# EAGLE design R3_CH340_Adapter (EAGLE 9.6.1)

## Sheet 1 of 3
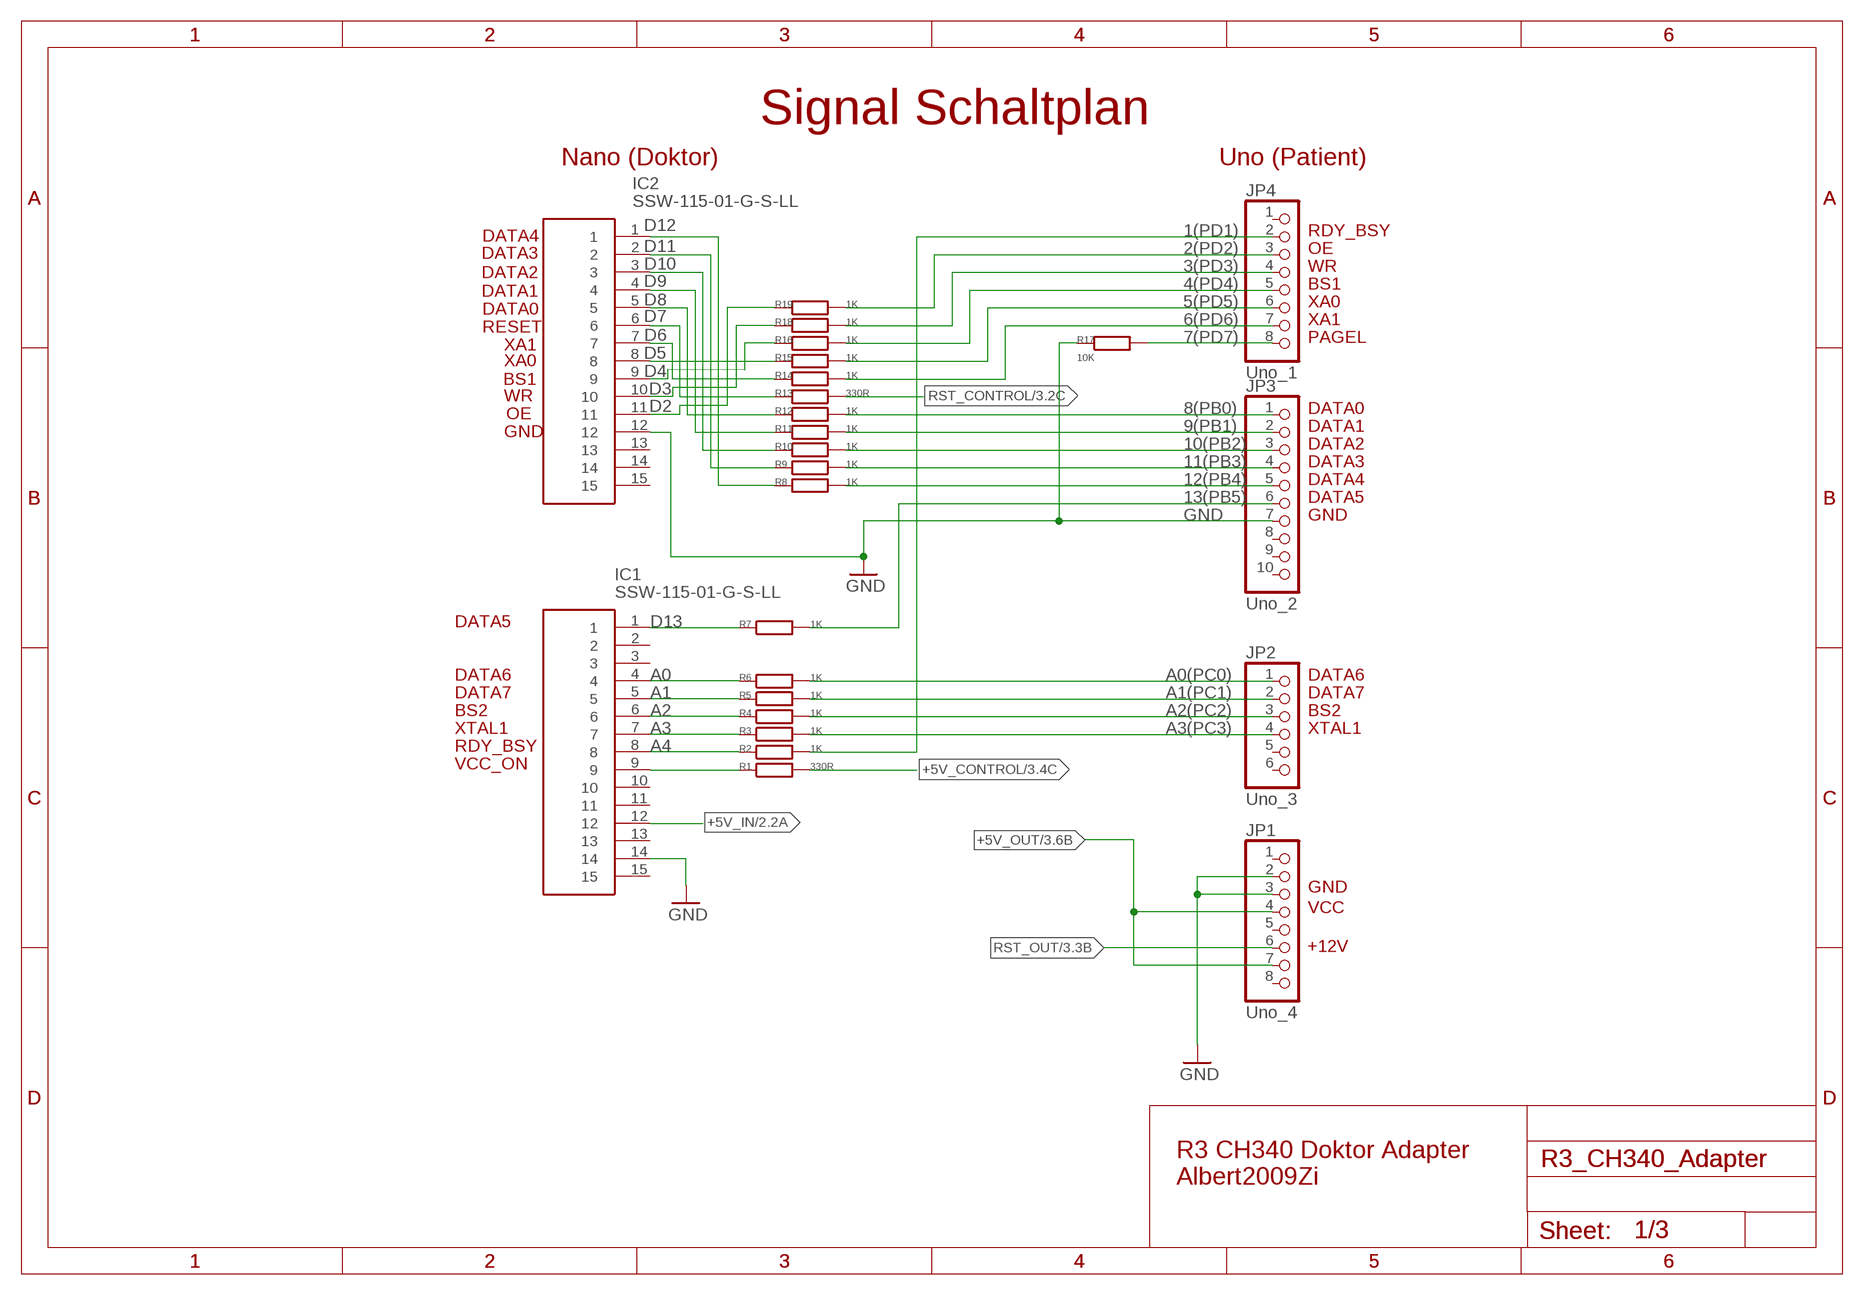
[diagram p0: schematic, sheet 1]

### Parts
IC1  SSW-115-01-G-S-LL  [RHDR15W79P0X254_1X15_3861X241X]
IC2  SSW-115-01-G-S-LL  [RHDR15W79P0X254_1X15_3861X241X]
JP1  Uno_4  PINHD-1X8  [1X08]
JP2  Uno_3  PINHD-1X6  [1X06]
JP3  Uno_2  PINHD-1X10  [1X10]
JP4  Uno_1  PINHD-1X8  [1X08]
R1  330R  R-EU_R0805  [R0805]
R2  1K  R-EU_R0805  [R0805]
R3  1K  R-EU_R0805  [R0805]
R4  1K  R-EU_R0805  [R0805]
R5  1K  R-EU_R0805  [R0805]
R6  1K  R-EU_R0805  [R0805]
R7  1K  R-EU_R0805  [R0805]
R8  1K  R-EU_R0805  [R0805]
R9  1K  R-EU_R0805  [R0805]
R10  1K  R-EU_R0805  [R0805]
R11  1K  R-EU_R0805  [R0805]
R12  1K  R-EU_R0805  [R0805]
R13  330R  R-EU_R0805  [R0805]
R14  1K  R-EU_R0805  [R0805]
R15  1K  R-EU_R0805  [R0805]
R16  1K  R-EU_R0805  [R0805]
R17  10K  R-EU_R0805  [R0805]
R18  1K  R-EU_R0805  [R0805]
R19  1K  R-EU_R0805  [R0805]

### Nets
1(PD1): JP4.2 R2.2
2(PD2): JP4.3 R19.2
3(PD3): JP4.4 R18.2
4(PD4): JP4.5 R16.2
5(PD5): JP4.6 R15.2
6(PD6): JP4.7 R14.2
7(PD7): JP4.8 R17.2
8(PB0): JP3.1 R12.2
9(PB1): JP3.2 R11.2
10(PB2): JP3.3 R10.2
11(PB3): JP3.4 R9.2
12(PB4): JP3.5 R8.2
13(PB5): JP3.6 R7.2
+5V_CONTROL: R1.2 ; also sheet 3
+5V_IN [PWR]: IC1.12 ; also sheet 2
+5V_OUT: JP1.4 JP1.7 ; also sheet 3
A0: IC1.4 R6.1
A0(PC0): JP2.1 R6.2
A1: IC1.5 R5.1
A1(PC1): JP2.2 R5.2
A2: IC1.6 R4.1
A2(PC2): JP2.3 R4.2
A3: IC1.7 R3.1
A3(PC3): JP2.4 R3.2
A4: IC1.8 R2.1
D2: IC2.11 R19.1
D3: IC2.10 R18.1
D4: IC2.9 R16.1
D5: IC2.8 R15.1
D6: IC2.7 R14.1
D7: IC2.6 R13.1
D8: IC2.5 R12.1
D9: IC2.4 R11.1
D10: IC2.3 R10.1
D11: IC2.2 R9.1
D12: IC2.1 R8.1
D13: IC1.1 R7.1
GND [GND]: IC1.14 IC2.12 JP1.2 JP1.3 JP3.7 R17.1 ; also sheet 2,3
RST_CONTROL: R13.2 ; also sheet 3
RST_OUT: JP1.6 ; also sheet 3
VCC_ON: IC1.9 R1.1
Unconnected: IC1.2 IC1.3 IC1.10 IC1.11 IC1.13 IC1.15 IC2.13 IC2.14 IC2.15 JP1.1 JP1.5 JP1.8 JP2.5 JP2.6 JP3.8 JP3.9 JP3.10 JP4.1

### Notes on the sheet
- Signal Schaltplan
- Nano (Doktor) | Uno (Patient)
- RDY_BSY
- DATA4
- DATA3 | OE
- WR
- DATA2
- BS1
- DATA1
- XA0
- DATA0
- XA1
- RESET
- PAGEL
- XA1
- XA0
- BS1
- WR
- DATA0
- OE
- DATA1
- GND
- DATA2
- DATA3
- DATA4
- DATA5
- GND
- DATA5
- DATA6 | DATA6
- DATA7 | DATA7
- BS2 | BS2
- XTAL1 | XTAL1
- RDY_BSY
- VCC_ON
- GND
- VCC
- +12V
- R3 CH340 Doktor Adapter
  Albert2009Zi

## Sheet 2 of 3
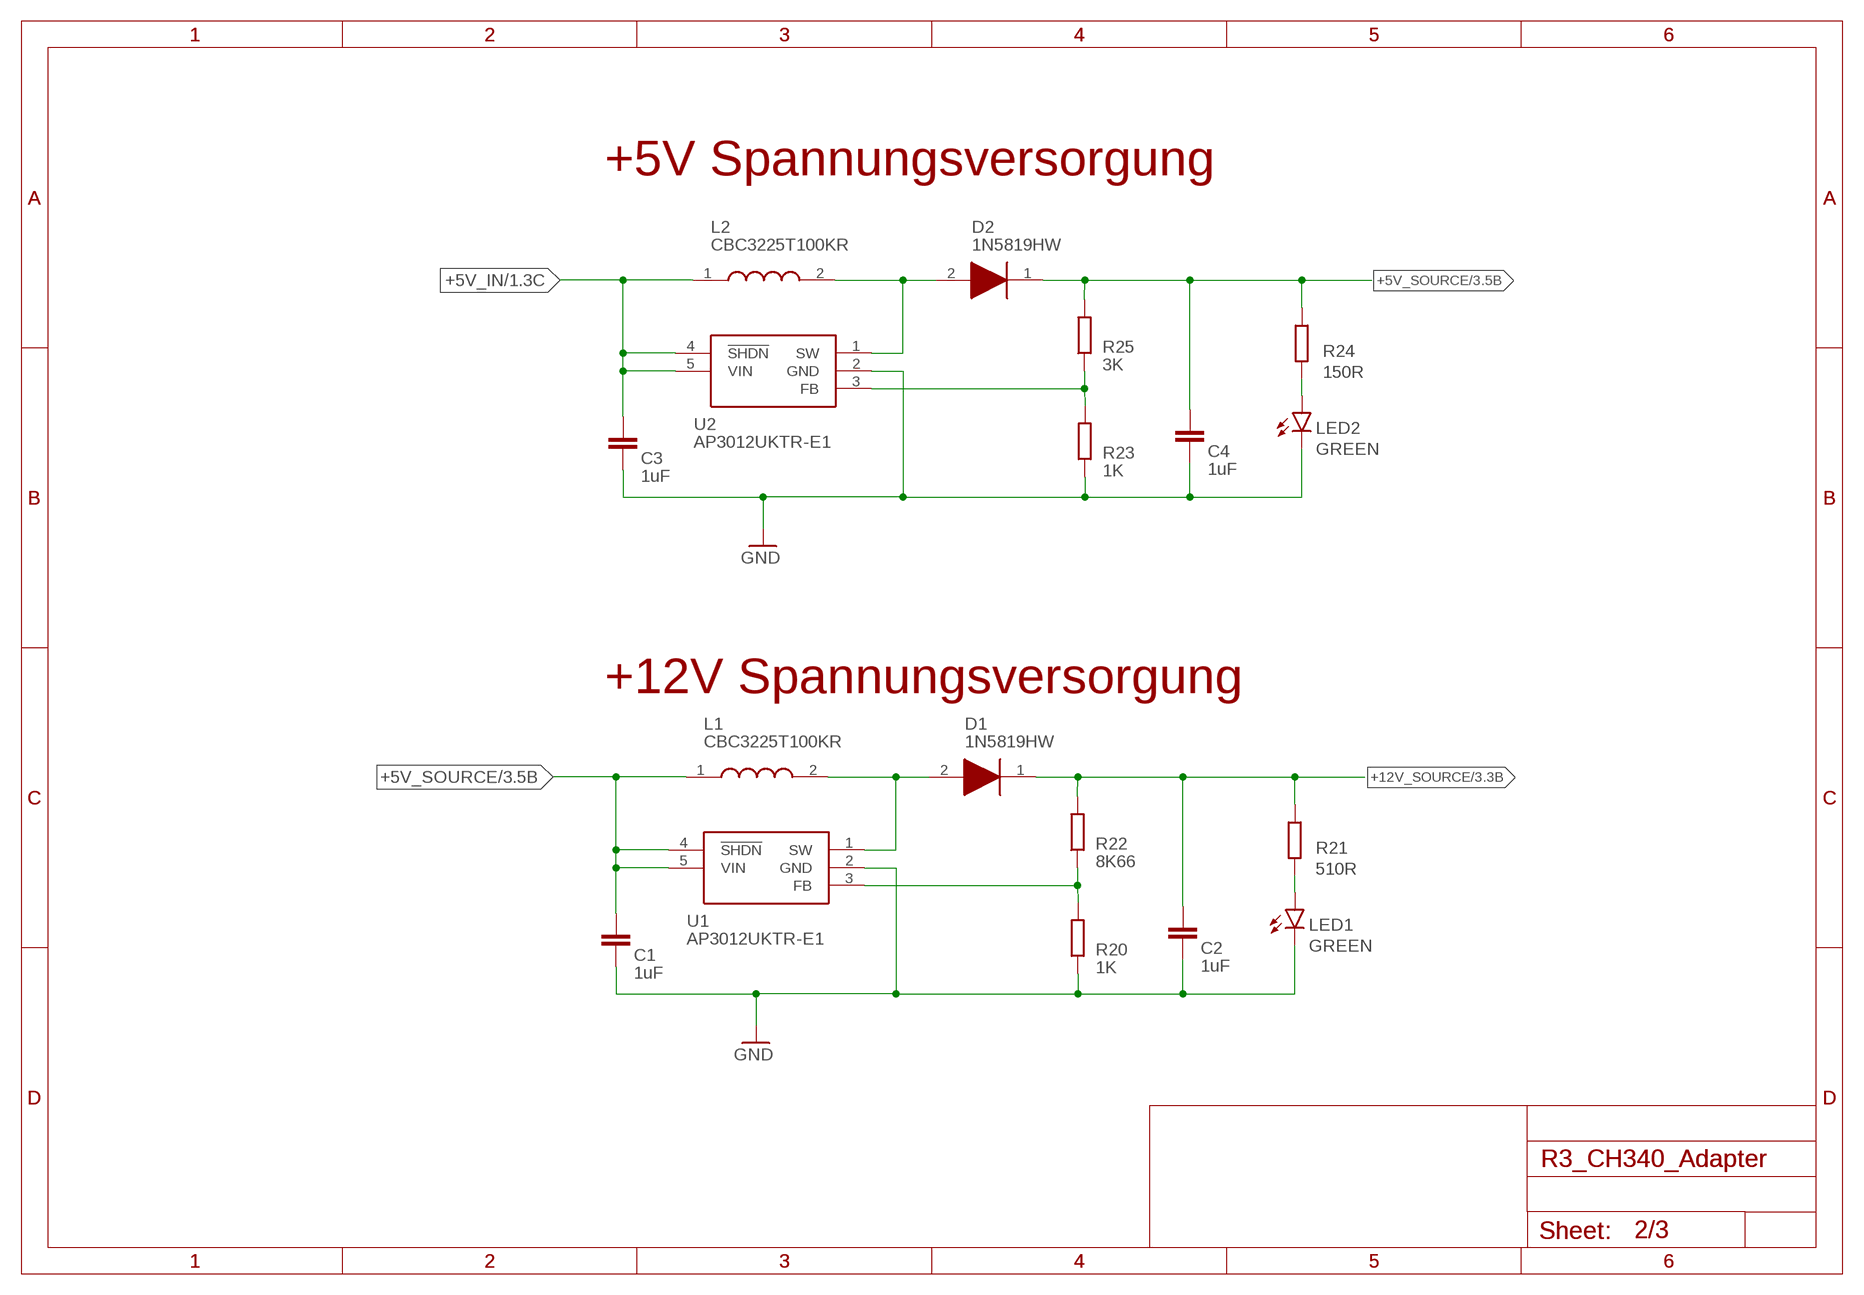
[diagram p1: schematic, sheet 2]

### Parts
C1  1uF  C-EUC0805  [C0805]
C2  1uF  C-EUC0805  [C0805]
C3  1uF  C-EUC0805  [C0805]
C4  1uF  C-EUC0805  [C0805]
D1  1N5819HW  [SOD3716X145N]
D2  1N5819HW  [SOD3716X145N]
L1  CBC3225T100KR  [INDC3225X270N]
L2  CBC3225T100KR  [INDC3225X270N]
LED1  GREEN  LEDCHIP-LED0805  [CHIP-LED0805]
LED2  GREEN  LEDCHIP-LED0805  [CHIP-LED0805]
R20  1K  R-EU_R0805  [R0805]
R21  510R  R-EU_R0805  [R0805]
R22  8K66  R-EU_R0805  [R0805]
R23  1K  R-EU_R0805  [R0805]
R24  150R  R-EU_R0805  [R0805]
R25  3K  R-EU_R0805  [R0805]
U1  AP3012UKTR-E1  [SOT95P280X145-5N]
U2  AP3012UKTR-E1  [SOT95P280X145-5N]

### Nets
+5V_IN [PWR]: C3.1 L2.1 U2.4(!SHDN) U2.5(VIN) ; also sheet 1
+5V_SOURCE [PWR]: C1.1 C4.1 D2.1(K) L1.1 R24.1 R25.2 U1.4(!SHDN) U1.5(VIN) ; also sheet 3
+12V_SOURCE [PWR]: C2.1 D1.1(K) R21.1 R22.2 ; also sheet 3
GND [GND]: C1.2 C2.2 C3.2 C4.2 LED1.C LED2.C R20.1 R23.1 U1.2(GND) U2.2(GND) ; also sheet 1,3
N$1: D2.2(A) L2.2 U2.1(SW)
N$3: R23.2 R25.1 U2.3(FB)
N$5: D1.2(A) L1.2 U1.1(SW)
N$6: R20.2 R22.1 U1.3(FB)
N$10: LED2.A R24.2
N$12: LED1.A R21.2

### Notes on the sheet
- +5V Spannungsversorgung
- +12V Spannungsversorgung

## Sheet 3 of 3
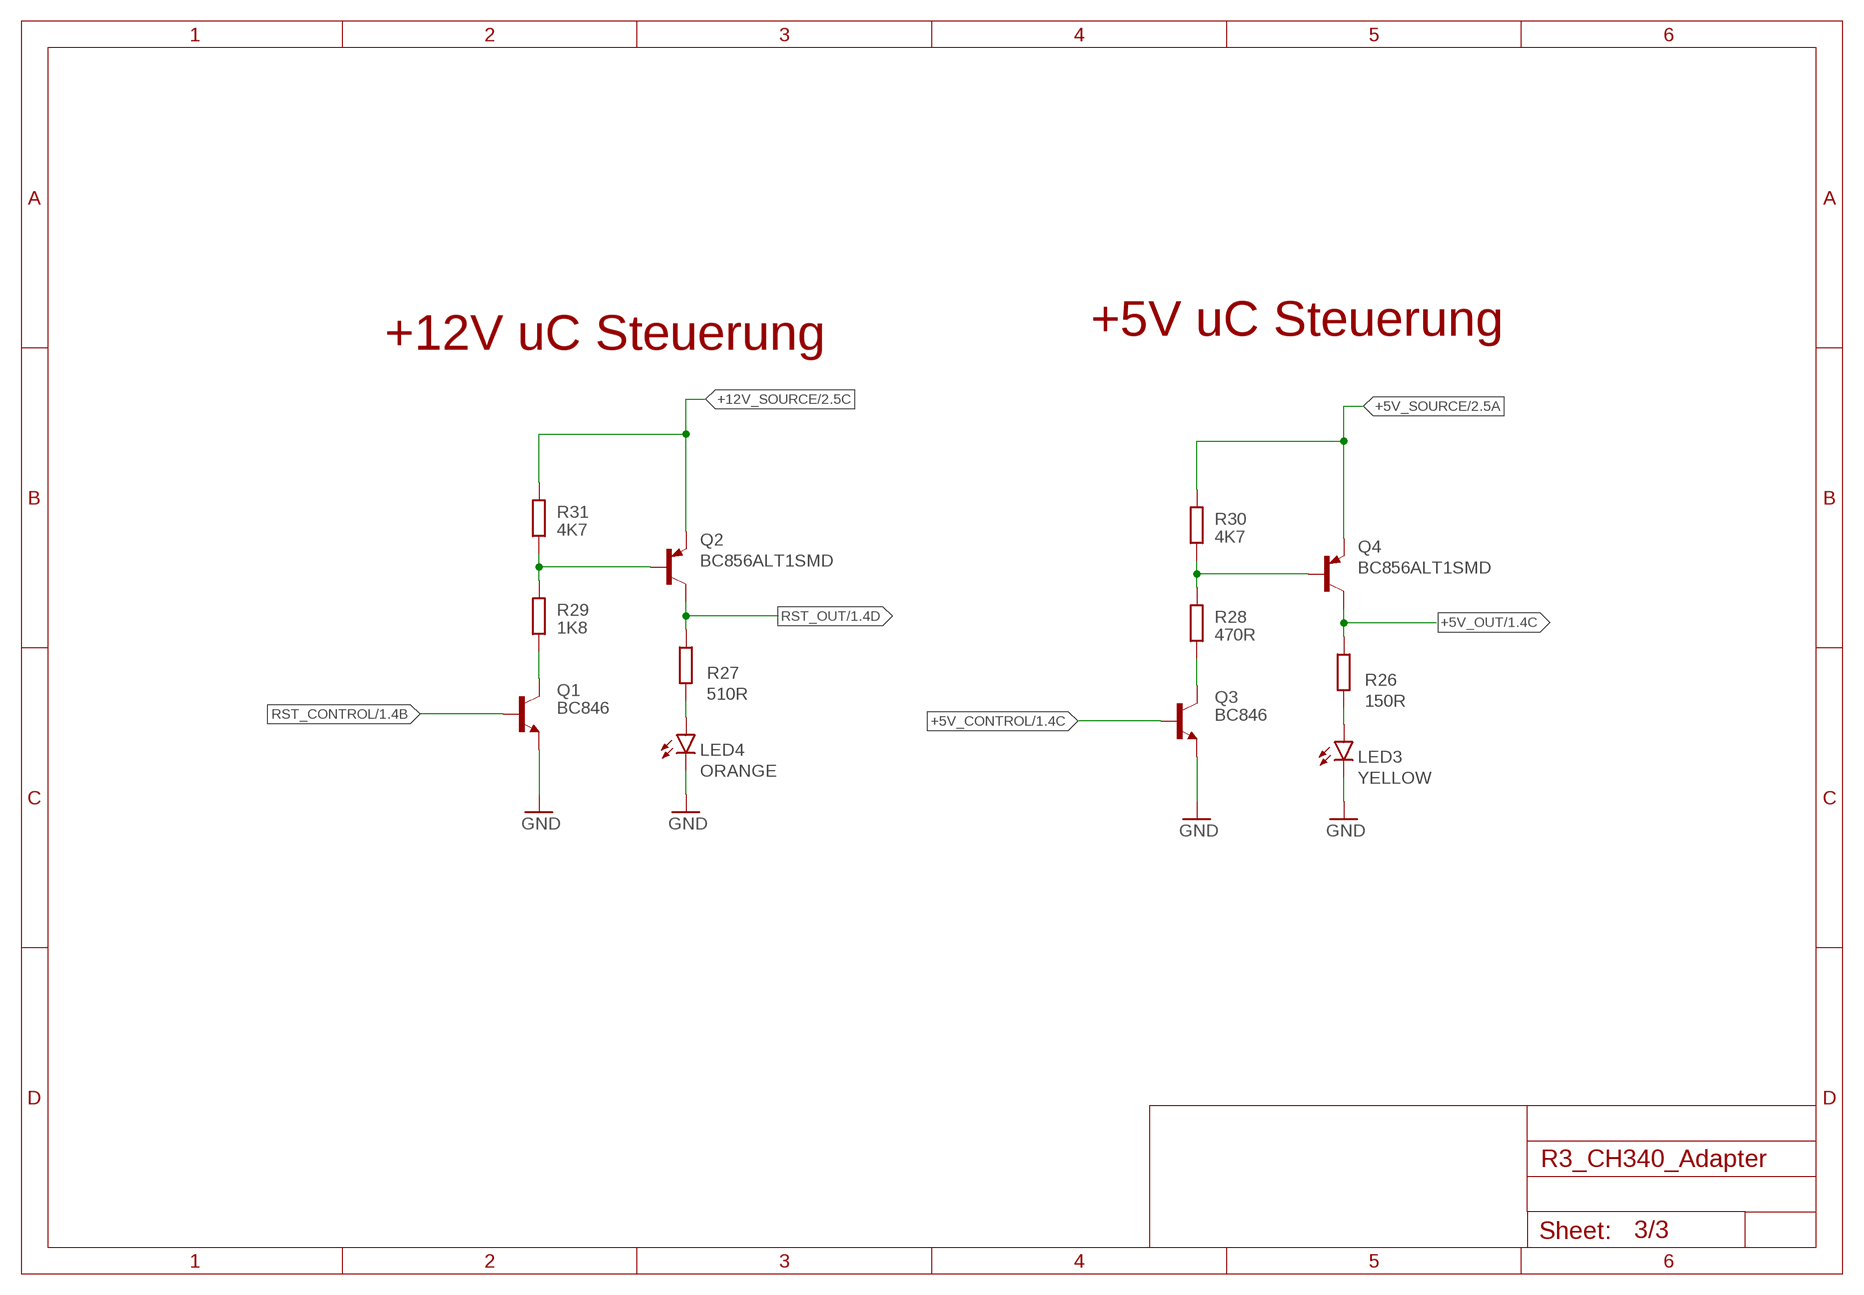
[diagram p2: schematic, sheet 3]

### Parts
LED3  YELLOW  LEDCHIP-LED0805  [CHIP-LED0805]
LED4  ORANGE  LEDCHIP-LED0805  [CHIP-LED0805]
Q1  BC846  [SOT23]
Q2  BC856ALT1SMD  [SOT23-BEC]
Q3  BC846  [SOT23]
Q4  BC856ALT1SMD  [SOT23-BEC]
R26  150R  R-EU_R0805  [R0805]
R27  510R  R-EU_R0805  [R0805]
R28  470R  R-EU_R0805  [R0805]
R29  1K8  R-EU_R0805  [R0805]
R30  4K7  R-EU_R0805  [R0805]
R31  4K7  R-EU_R0805  [R0805]

### Nets
+5V_CONTROL: Q3.1(B) ; also sheet 1
+5V_OUT: Q4.C R26.1 ; also sheet 1
+5V_SOURCE [PWR]: Q4.E R30.2 ; also sheet 2
+12V_SOURCE [PWR]: Q2.E R31.2 ; also sheet 2
GND [GND]: LED3.C LED4.C Q1.2(E) Q3.2(E) ; also sheet 1,2
N$2: Q2.B R29.2 R31.1
N$4: LED4.A R27.2
N$7: Q4.B R28.2 R30.1
N$8: LED3.A R26.2
N$9: Q3.3(C) R28.1
N$11: Q1.3(C) R29.1
RST_CONTROL: Q1.1(B) ; also sheet 1
RST_OUT: Q2.C R27.1 ; also sheet 1

### Notes on the sheet
- +12V uC Steuerung | +5V uC Steuerung

## Library data of the parts
C1-C4 = rcl:C-EU: CAPACITOR, European symbol; SPICEPREFIX: C
D1 D2 = Schottky_1N58xx:1N5819HW: 1.0A SURFACE MOUNT SCHOTTKY BARRIER RECTIFIER Source: Datasheet <http://www.diodes.com/_files/datasheets/ds30217.pdf>; DESCRIPTION: 1.0A SURFACE MOUNT SCHOTTKY BARRIER RECTIFIER; HEIGHT: 1.45mm; MANUFACTURER_NAME: Diodes Inc.; MANUFACTURER_PART_NUMBER: 1N5819HW
IC1 IC2 = SamacSys_Parts:SSW-115-01-G-S-LL: Board to Board & Mezzanine Connectors .100" Tiger Buy Socket Strip Source: Datasheet <https://componentsearchengine.com/Datasheets/1/SSW-115-01-G-S-LL.pdf>; ARROW_PART_NUMBER: SSW-115-01-G-S-LL; ARROW_PRICE-STOCK: https://www.arrow.com/en/products/ssw-115-01-g-s-ll/samtec?region=nac; DESCRIPTION: Board to Board & Mezzanine Connectors .100" Tiger Buy Socket Strip; HEIGHT: 8.51mm; MANUFACTURER_NAME: SAMTEC; MANUFACTURER_PART_NUMBER: SSW-115-01-G-S-LL; MOUSER_PART_NUMBER: 200-SSW11501GSLL; MOUSER_PRICE-STOCK: https://www.mouser.co.uk/ProductDetail/Samtec/SSW-115-01-G-S-LL?qs=rU5fayqh%252BE2DWkaSQZyn6w%3D%3D
JP1 JP4 = pinhead:PINHD-1X8: PIN HEADER
JP2 = pinhead:PINHD-1X6: PIN HEADER
JP3 = pinhead:PINHD-1X10: PIN HEADER
L1 L2 = SMD_Indukt:CBC3225T100KR: Fixed Inductors 1210 10uH 172.9mOhms +/-10% 900mA HiCur Source: Datasheet <https://mouser.componentsearchengine.com/Datasheets/1/CBC3225T100KR.pdf>; ARROW_PART_NUMBER: CBC3225T100KR; ARROW_PRICE-STOCK: https://www.arrow.com/en/products/cbc3225t100kr/taiyo-yuden; DESCRIPTION: Fixed Inductors 1210 10uH 172.9mOhms +/-10% 900mA HiCur; HEIGHT: 2.7mm; MANUFACTURER_NAME: TAIYO YUDEN; MANUFACTURER_PART_NUMBER: CBC3225T100KR; MOUSER_PART_NUMBER: 963-CBC3225T100KR; MOUSER_PRICE-STOCK: https://www.mouser.co.uk/ProductDetail/Taiyo-Yuden/CBC3225T100KR?qs=I6KAKw0tg2xBtBHDie3dYA%3D%3D
LED1-LED4 = led:LED: LED OSRAM: - CHIPLED LG R971, LG N971, LY N971, LG Q971, LY Q971, LO R971, LY R971 LH N974, LH R974 LS Q976, LO Q976, LY Q976 LO Q996 - Hyper CHIPLED LW Q18S LB Q993, LB Q99A, LB R99A - SideLED LS A670, LO A670, LY A670, LG A670, LP A670 LB A673, LV A673, LT A673, LW A673 LH A674 LY A675 LS A676, LA A676, LO A676, LY A676, LW A676 LS A679, LY A679, LG A679 - Hyper Micro SIDELED® LS Y876, LA Y876, LO Y876, LY Y876 LT Y87S - SmartLED LW L88C, LW L88S LB L89C, LB L89S, LG L890 LS L89K, LO L89K, LY L89K LS L896, LA L896, LO L896, LY L896 - TOPLED LS T670, LO T670, LY T670, LG T670, LP T670 LSG T670, LSP T670, LSY T670, LOP T670, LYG T670 LG T671, LOG T671, LSG T671 LB T673, LV T673, LT T673, LW T673 LH T674 LS T676, LA T676, LO T676, LY T676, LB T676, LH T676, LSB T676, LW T676 LB T67C, LV T67C, LT T67C, LS T67K, LO T67K, LY T67K, LW E67C LS E67B, LA E67B, LO E67B, LY E67B, LB E67C, LV E67C, LT E67C LW T67C LS T679, LY T679, LG T679 LS T770, LO T770, LY T770, LG T770, LP T770 LB T773, LV T773, LT T773, LW T773 LH T774 LS E675, LA E675, LY E675, LS T675 LS T776, LA T776, LO T776, LY T776, LB T776 LHGB T686 LT T68C, LB T68C - Hyper Mini TOPLED® LB M676 - Mini TOPLED Santana® LG M470 LS M47K, LO M47K, LY M47K Source: http://www.osram.convergy.de LUXEON: - LUMILED® LXK2-PW12-R00, LXK2-PW12-S00, LXK2-PW14-U00, LXK2-PW14-V00 LXK2-PM12-R00, LXK2-PM12-S00, LXK2-PM14-U00 LXK2-PE12-Q00, LXK2-PE12-R00, LXK2-PE12-S00, LXK2-PE14-T00, LXK2-PE14-U00 LXK2-PB12-K00, LXK2-PB12-L00, LXK2-PB12-M00, LXK2-PB14-N00, LXK2-PB14-P00, LXK2-PB14-Q00 LXK2-PR12-L00, LXK2-PR12-M00, LXK2-PR14-Q00, LXK2-PR14-R00 LXK2-PD12-Q00, LXK2-PD12-R00, LXK2-PD12-S00 LXK2-PH12-R00, LXK2-PH12-S00 LXK2-PL12-P00, LXK2-PL12-Q00, LXK2-PL12-R00 Source: www.luxeon.com KINGBRIGHT: KA-3528ASYC Source: www.kingbright.com
Q1 Q3 = transistor:BC846: NPN TRANSISTOR
Q2 Q4 = transistor-pnp:BC856*: PNP Transistror
R1-R31 = rcl:R-EU_: RESISTOR, European symbol; SPICEPREFIX: R
U1 U2 = Baby_Moji_Spannungsplatine:AP3012UKTR-E1: IC REG BOOST ADJ 500MA SOT23-5 Source: Datasheet <https://componentsearchengine.com/Datasheets/1/AP3012UKTR-E1.pdf>; ARROW_PART_NUMBER: AP3012UKTR-E1; ARROW_PRICE-STOCK: https://www.arrow.com/en/products/ap3012uktr-e1/diodes-incorporated; DESCRIPTION: IC REG BOOST ADJ 500MA SOT23-5; HEIGHT: 1.45mm; MANUFACTURER_NAME: Diodes Inc.; MANUFACTURER_PART_NUMBER: AP3012UKTR-E1; MOUSER_PART_NUMBER: 621-AP3012UKTR-E1; MOUSER_PRICE-STOCK: https://www.mouser.com/Search/Refine.aspx?Keyword=621-AP3012UKTR-E1

## Net classes
0 default: width 0.152 mm, drill 0.3 mm, clearance 0.152 mm
1 GND: width 0.406 mm, drill 0.4 mm, clearance 0.3 mm
2 PWR: width 0.406 mm, drill 0.4 mm, clearance 0.152 mm

## Board
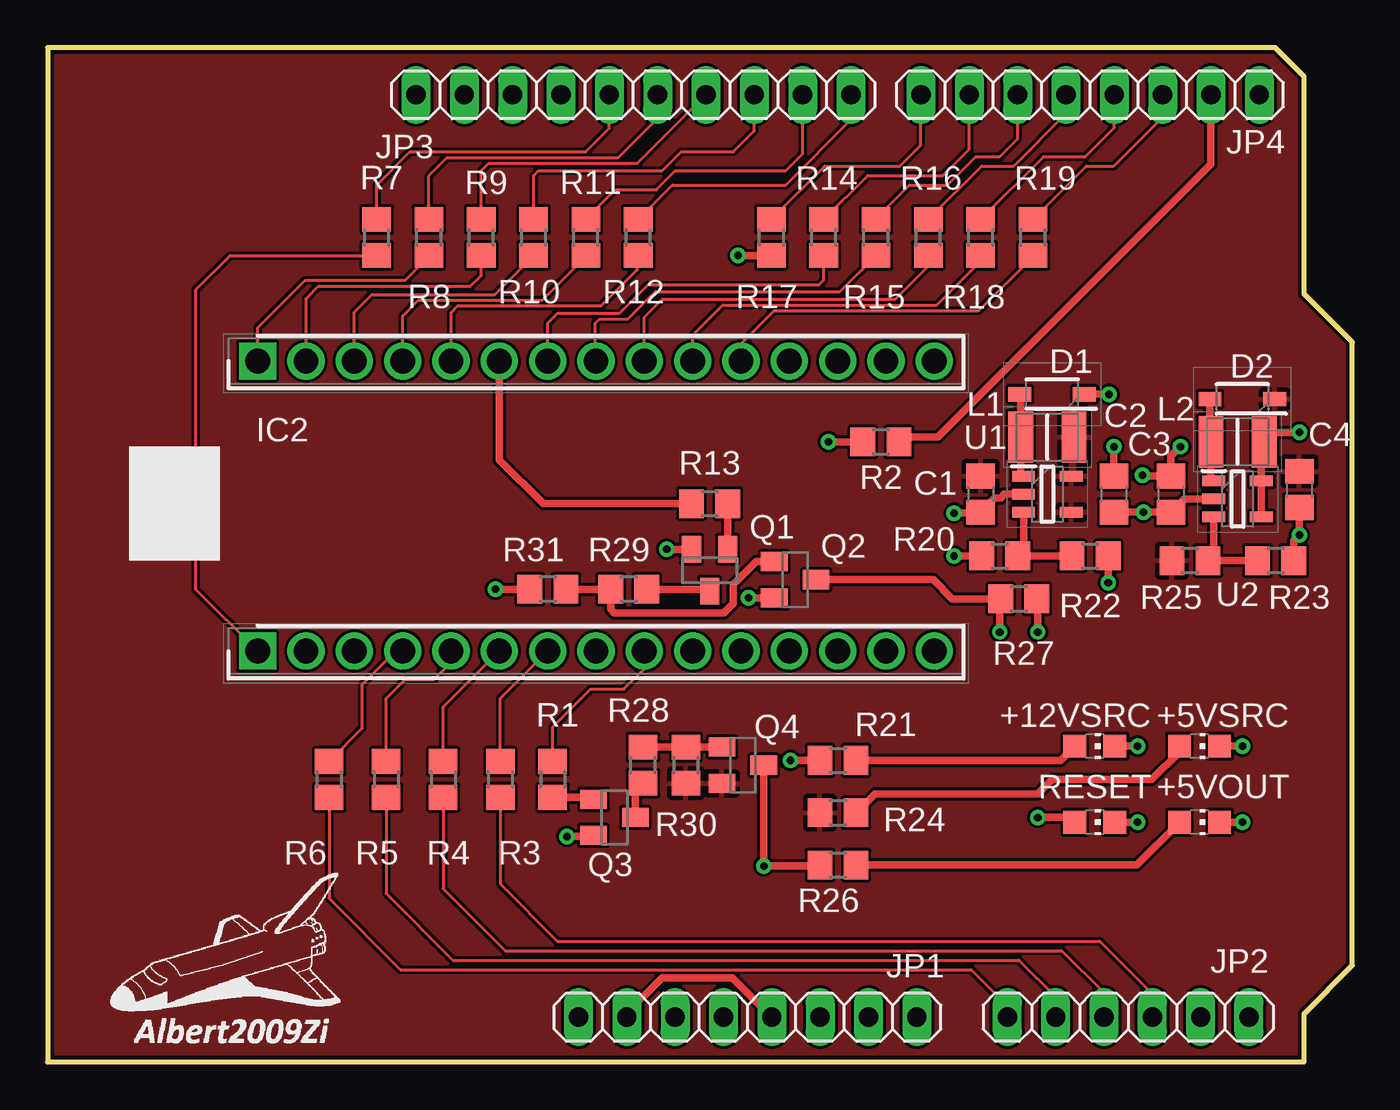
[diagram p3: board, top side]
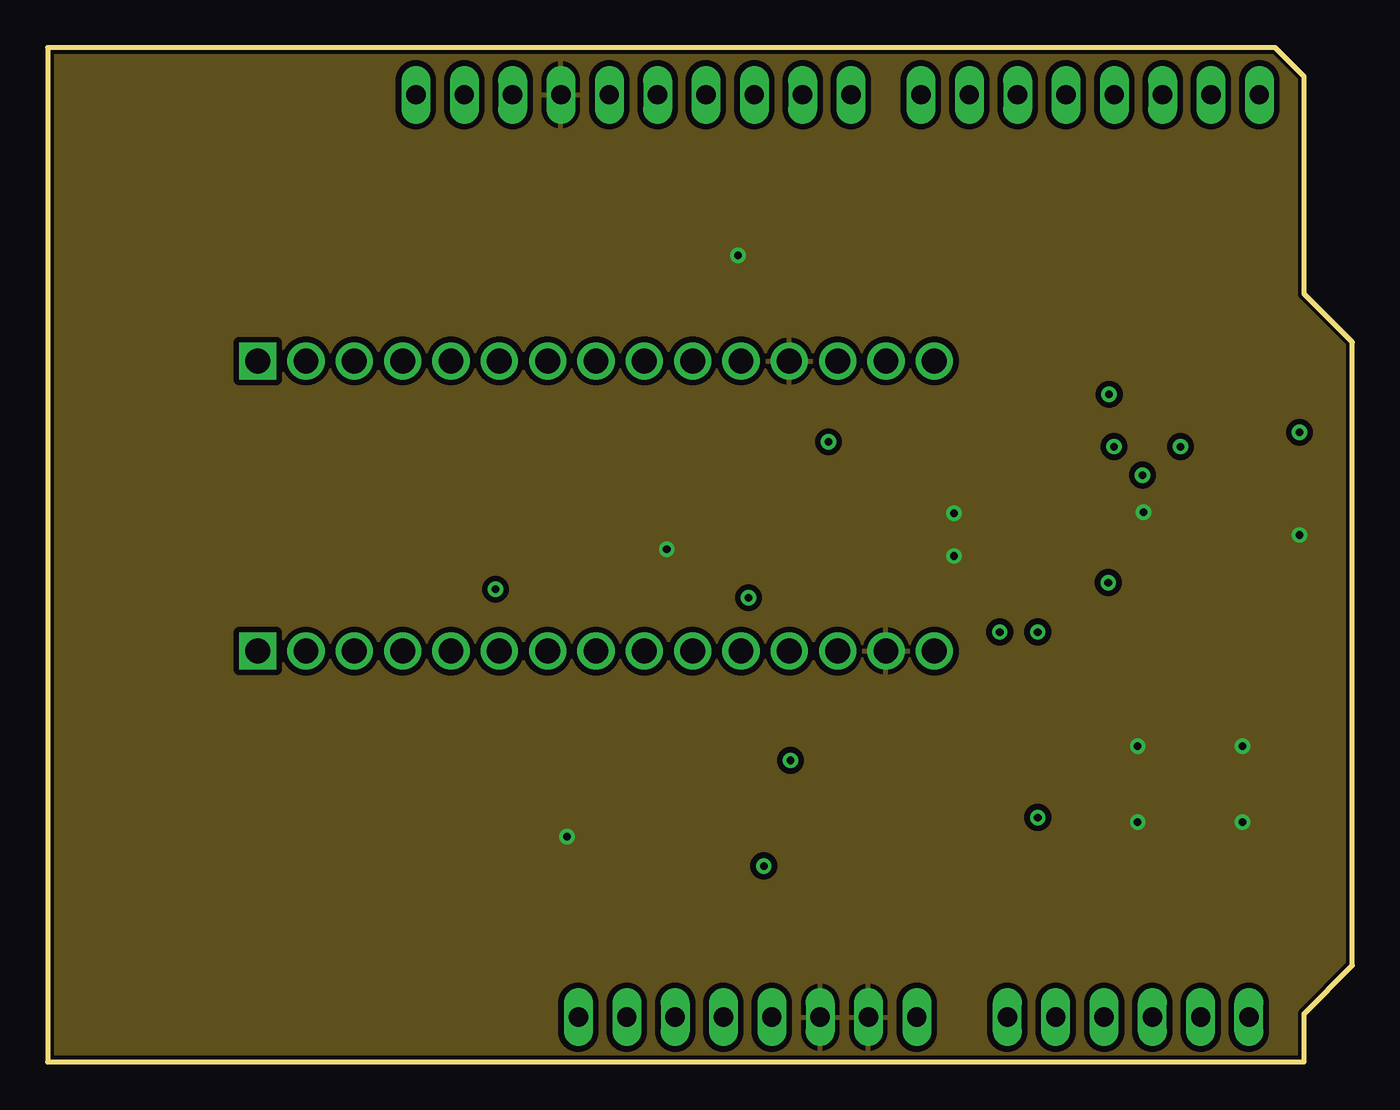
[diagram p4: board, inner layer Route2]
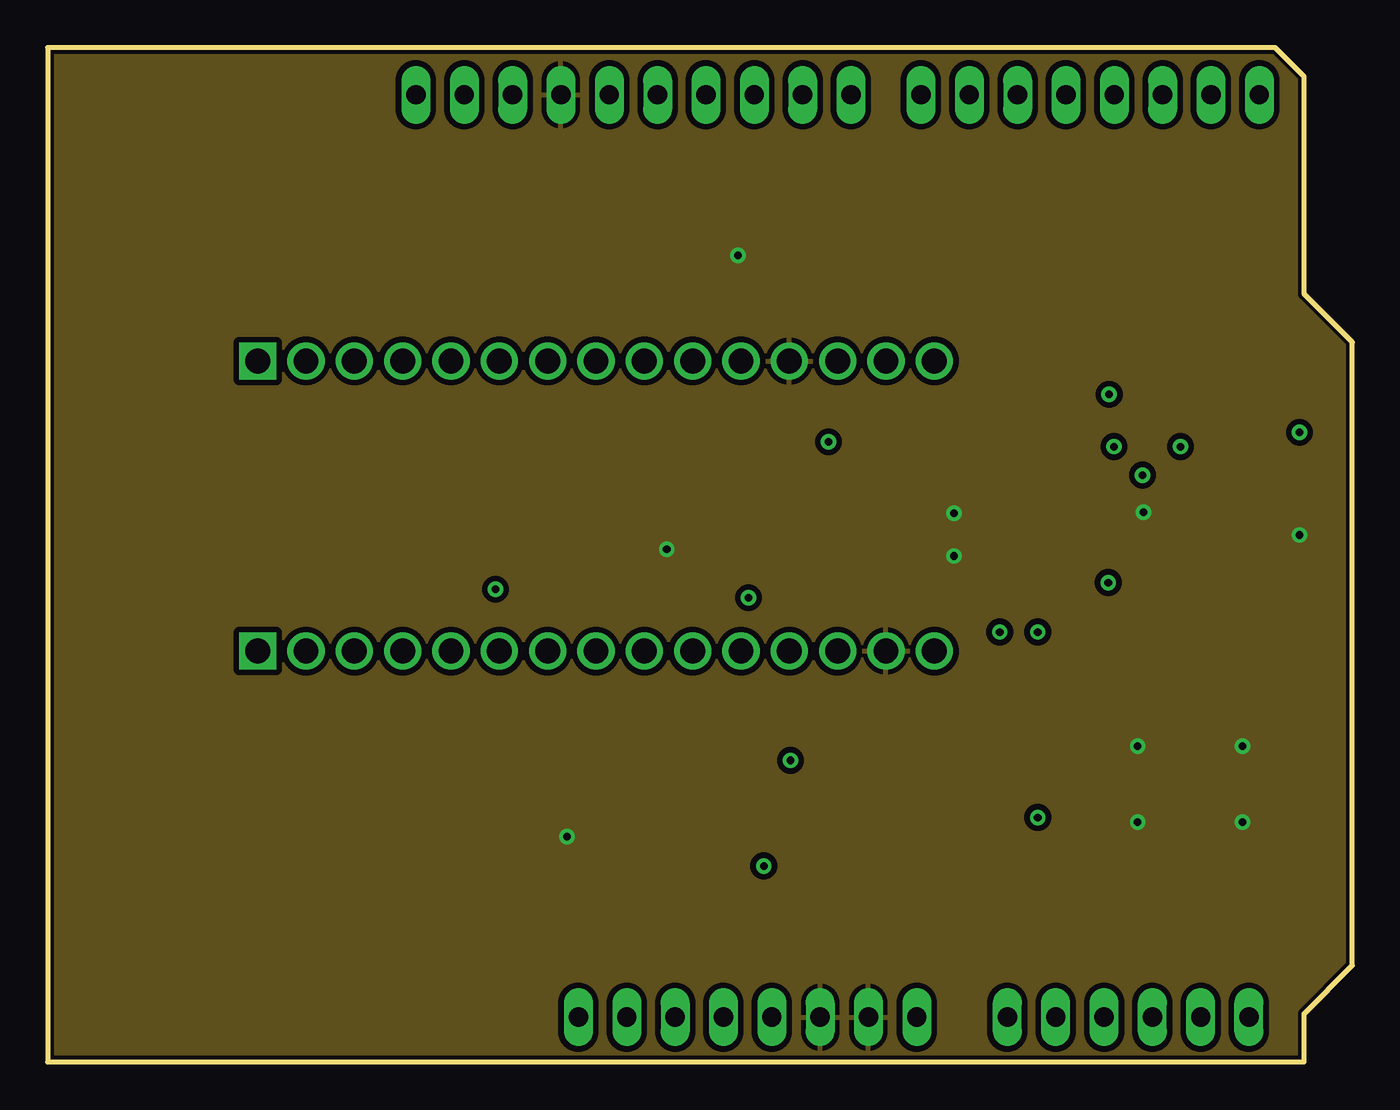
[diagram p5: board, inner layer Route15]
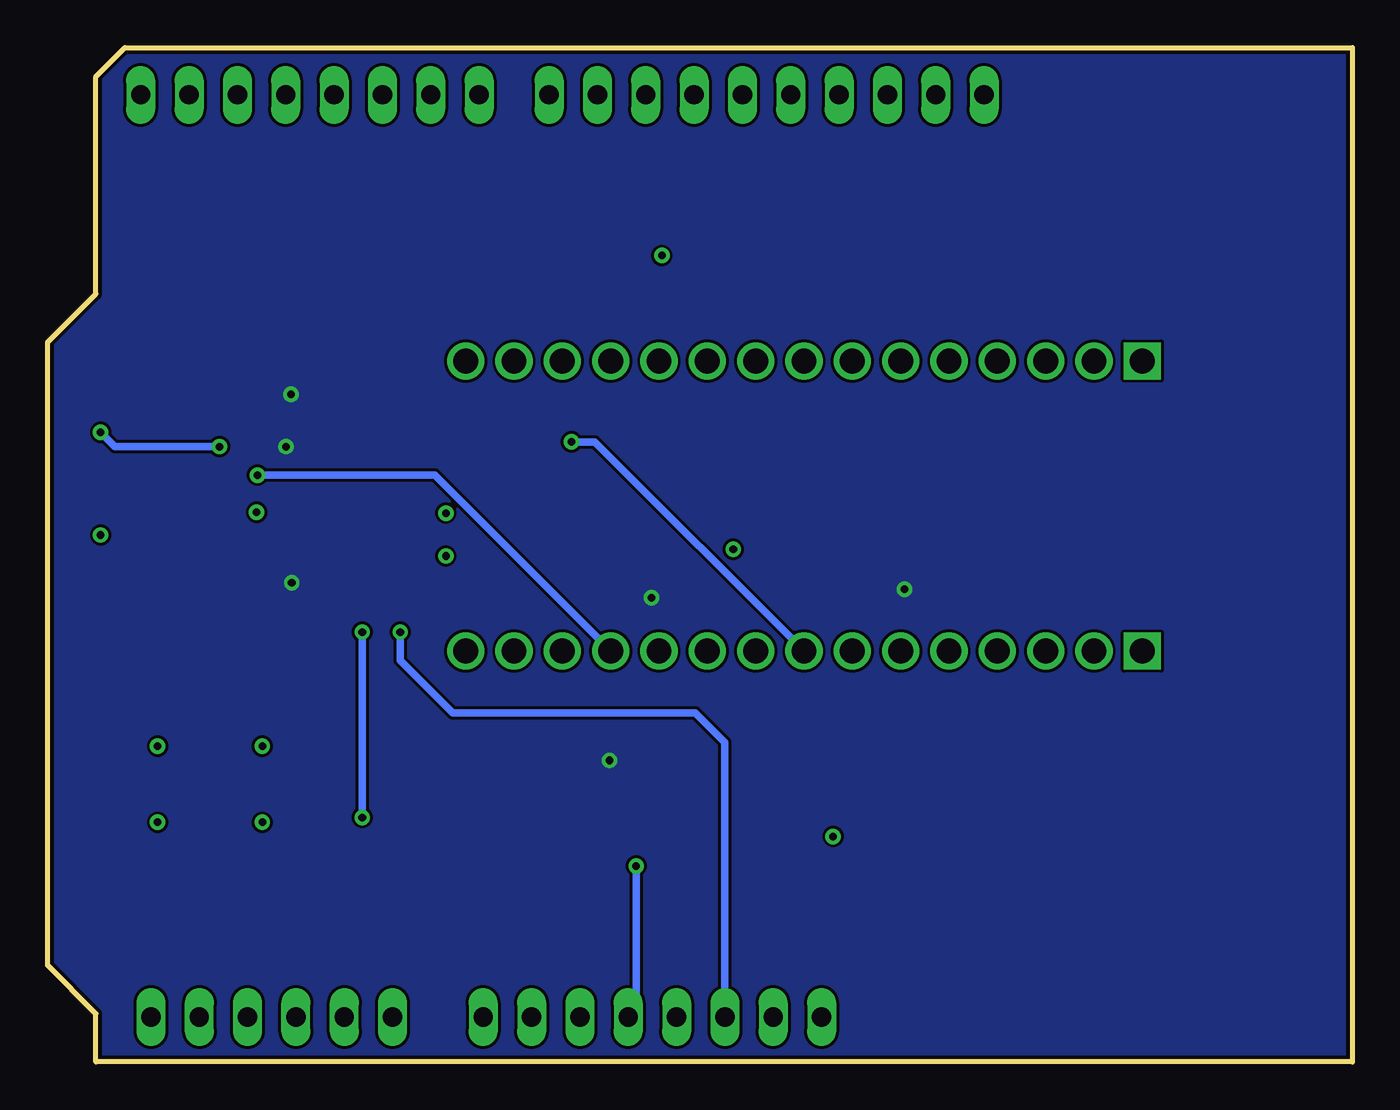
[diagram p6: board, bottom side, seen from below]

Size 68.58 x 53.34 mm. Coordinates in mm from the lower left corner, seen from the top.
Outline: 0,53.34 0,0 66.04,0 66.04,2.54 68.58,5.08 68.58,37.85 66.04,40.39 66.04,51.82 64.52,53.34 0,53.34
Copper layers (1+2*15+16): Top 0.035mm / dielectric 0.6mm / Route2 0.035mm / dielectric 0.25mm / Route15 0.035mm / dielectric 0.6mm / Bottom 0.035mm
Design rules "default *": minimum track width 3mil, minimum drill 12mil, track to track 6mil, track to pad 6mil, pad to pad 6mil, via to via 6mil, smd to smd 6mil, copper to edge 0.2mm, drill to drill 32mil, minimum pad ring 10mil, minimum via ring 8mil, stop-mask expansion 4mil, vias tented up to drill 0mil, thermal gap 10mil

### Footprints (pad centres in the part's own frame; a part is rotated, then mirrored left to right if it is on the bottom)
C0805 = smd 1.3 x 1.5: 1 -0.95,0; 2 0.95,0
SOD3716X145N = smd 1.2 x 0.75: 1 -1.7,0; 2 1.7,0
RHDR15W79P0X254_1X15_3861X241X = drill 1.3 pad 1.95 square: 1 0,0 | drill 1.3 pad 1.95: 2 -2.54,0; 3 -5.08,0; 4 -7.62,0; 5 -10.16,0; 6 -12.7,0; 7 -15.24,0; 8 -17.78,0; 9 -20.32,0; 10 -22.86,0; 11 -25.4,0; 12 -27.94,0; 13 -30.48,0; 14 -33.02,0; 15 -35.56,0
1X08 = drill 1.016 long: 1 -8.89,0; 2 -6.35,0; 3 -3.81,0; 4 -1.27,0; 5 1.27,0; 6 3.81,0; 7 6.35,0; 8 8.89,0
1X06 = drill 1.016 long: 1 -6.35,0; 2 -3.81,0; 3 -1.27,0; 4 1.27,0; 5 3.81,0; 6 6.35,0
1X10 = drill 1.016 long: 1 -11.43,0; 2 -8.89,0; 3 -6.35,0; 4 -3.81,0; 5 -1.27,0; 6 1.27,0; 7 3.81,0; 8 6.35,0; 9 8.89,0; 10 11.43,0
INDC3225X270N = smd 1.3 x 2.7: 1 -1.4,0; 2 1.4,0
CHIP-LED0805 = smd 1.2 x 1.2: A 0,-1.05; C 0,1.05
SOT23 = smd 1 x 1.4: 1 -0.95,-1.1; 2 0.95,-1.1; 3 0,1.1
SOT23-BEC = smd 1 x 1.4: B -0.95,-1.1; C 0,1.1; E 0.95,-1.1
R0805 = smd 1.3 x 1.5: 1 -0.95,0; 2 0.95,0
SOT95P280X145-5N = smd 1.2 x 0.55: 1 -1.25,0.95; 2 -1.25,0; 3 -1.25,-0.95; 4 1.25,-0.95; 5 1.25,0.95

### Placement (x,y rotation side)
C1  49.04,29.86 270 top
C2  56.04,29.86 270 top
C3  59.04,29.86 270 top
C4  65.79,30.11 270 top
D1  52.79,35.11 180 top
D2  62.79,34.86 180 top
E$1  [LOGO_SMALL]  3.04,0.61 0 top
IC1  11.04,21.61 180 top
IC2  11.04,36.86 180 top
JP1  36.79,2.36 180 top
JP2  56.79,2.36 0 top
JP3  30.79,50.86 180 top
JP4  54.79,50.86 180 top
L1  52.54,32.86 180 top
L2  62.54,32.61 180 top
LED1  55.04,16.61 270 top
LED2  60.54,16.61 270 top
LED3  60.54,12.61 270 top
LED4  55.04,12.61 270 top
Q1  34.79,25.86 180 top
Q2  39.29,25.36 270 top
Q3  29.79,12.86 270 top
Q4  36.54,15.61 270 top
R1  26.54,14.86 270 top
R2  43.79,32.61 0 top
R3  23.79,14.86 270 top
R4  20.79,14.86 270 top
R5  17.79,14.86 270 top
R6  14.79,14.86 270 top
R7  17.29,43.36 90 top
R8  20.04,43.36 90 top
R9  22.79,43.36 90 top
R10  25.54,43.36 90 top
R11  28.29,43.36 90 top
R12  31.04,43.36 90 top
R13  34.79,29.36 0 top
R14  40.79,43.36 90 top
R15  43.54,43.36 90 top
R16  46.29,43.36 90 top
R17  38.04,43.36 90 top
R18  49.04,43.36 90 top
R19  51.79,43.36 90 top
R20  50.04,26.61 0 top
R21  41.54,15.86 0 top
R22  54.79,26.61 0 top
R23  64.54,26.36 180 top
R24  41.54,13.11 0 top
R25  60.04,26.36 180 top
R26  41.54,10.36 0 top
R27  51.04,24.36 0 top
R28  1K8  [R0805]  31.29,15.61 90 top
R29  30.54,24.86 180 top
R30  33.54,15.61 270 top
R31  26.29,24.86 180 top
U1  52.54,29.86 0 top
U2  62.54,29.61 0 top

### Tracks (layer width: path | path; a pad name or v marks a point on that pad's centre or on a via)
1(PD1)
  Top 0.406: R2.2 44.99,32.86 46.79,32.86 61.14,47.21 JP4.2
2(PD2)
  Top 0.152: R19.2 54.59,47.11 56.04,47.11 58.6,49.67 JP4.3
3(PD3)
  Top 0.152: R18.2 52.34,47.61 54.54,47.61 56.06,49.13 JP4.4
4(PD4)
  Top 0.152: R16.2 49.09,47.11 50.77,47.11 53.52,49.86 JP4.5
5(PD5)
  Top 0.152: JP4.6 50.98,48.55 50.04,47.61 48.79,47.61 47.29,46.11 45.29,46.11 43.54,44.36 R15.2
6(PD6)
  Top 0.152: R14.2 43.09,46.61 47.04,46.61 48.44,48.01 JP4.7
7(PD7)
  Top 0.152: R17.2 40.84,47.11 44.79,47.11 45.9,48.22 JP4.8
8(PB0)
  Top 0.152: R12.2 32.84,46.11 38.79,46.11 42.22,49.54 JP3.1
9(PB1)
  Top 0.152: R11.2 29.84,45.86 31.99,45.86 32.99,46.86 38.79,46.86 39.68,47.75 JP3.2
10(PB2)
  Top 0.152: R10.2 25.54,46.61 25.79,46.86 32.29,46.86 33.29,47.86 36.04,47.86 37.14,48.96 JP3.3
11(PB3)
  Top 0.152: R9.2 22.79,46.86 23.18,47.25 30.99,47.25 JP3.4
12(PB4)
  Top 0.152: R8.2 20.04,46.61 20.99,47.55 29.99,47.55 32.06,49.63 JP3.5
13(PB5)
  Top 0.152: R7.2 17.29,46.11 19.04,47.86 28.29,47.86 29.52,49.09 JP3.6
+5V_CONTROL
  Top 0.406: R1.2 28.59,13.91 Q3.1
+5V_IN  (via drill 0.4)
  Top 0.406: U2.4 U2.5 63.79,32.46 L2.1 64.44,33.11 v65.79,33.11 | v59.54,32.36 59.04,31.86 C3.1 57.59,30.81 v57.54,30.86
  Bottom 0.406: v65.79,33.11 65.04,32.36 v59.54,32.36 | v57.54,30.86 48.23,30.86 IC1.12
+5V_OUT  (via drill 0.4)
  Top 0.406: Q4.C v37.64,10.31 40.54,10.31 R26.1 | JP1.4 36,4.43 32.29,4.43 30.44,2.58 JP1.7
  Bottom 0.406: v37.64,10.31 37.64,2.78 JP1.4
+5V_SOURCE
  pour Top: -0.21,53.49 64.56,53.59 66.29,51.86 66.24,40.51 68.79,37.96 68.79,4.86 66.29,2.36 66.29,-0.19 -0.21,-0.19
+12V_SOURCE  (via drill 0.4)
  Top 0.406: C2.1 v56.04,32.36 | R22.2 v55.74,25.21 | D1.1 v55.79,35.11 | R31.2 v23.54,24.86 | Q2.E v36.84,24.41 | R21.1 v39.04,15.86
  pour Bottom: -0.31,53.47 64.68,53.47 66.24,51.91 66.24,40.51 68.81,37.92 68.8,4.96 66.29,2.46 66.29,-0.24 -0.31,-0.24
A0
  Top 0.152: R6.1 16.54,17.56 16.54,19.86 18.29,21.61 IC1.4
A0(PC0)
  Top 0.152: R6.2 14.79,8.61 18.54,4.86 48.54,4.86 50.44,2.96 JP2.1
A1
  Top 0.152: R5.1 17.79,19.11 18.79,20.11 20.29,20.11 21.2,21.02 IC1.5
A1(PC1)
  Top 0.152: R5.2 17.79,8.86 21.29,5.36 51.04,5.36 52.98,3.42 JP2.2
A2
  Top 0.152: R4.1 20.79,18.66 IC1.6
A2(PC2)
  Top 0.152: R4.2 20.79,9.11 24.04,5.86 53.29,5.86 55.52,3.63 JP2.3
A3
  Top 0.152: R3.1 23.79,19.12 IC1.7
A3(PC3)
  Top 0.152: R3.2 23.79,9.36 26.79,6.36 55.29,6.36 58.06,3.59 JP2.4
A4  (via drill 0.4)
  Top 0.406: v41.04,32.61 R2.1
  Bottom 0.406: IC1.8 39.82,32.61 v41.04,32.61
D2
  Top 0.152: IC2.11 36.44,37.76 38.18,39.5 48.93,39.5 51.79,42.36 R19.1
D3
  Top 0.152: IC2.10 33.9,38.22 35.49,39.8 46.74,39.8 49.04,42.11 R18.1
D4
  Top 0.152: IC2.9 31.36,39.18 32.29,40.11 44.54,40.11 46.29,41.86 R16.1
D5
  Top 0.152: IC2.8 28.79,36.89 28.79,38.86 28.99,39.05 30.49,39.05 31.94,40.51 41.64,40.51 R15.1
D6
  Top 0.152: IC2.7 26.28,38.85 26.79,39.36 30.04,39.36 31.54,40.86 40.54,40.86 40.79,41.11 R14.1
D7
  Top 0.406: IC2.6 23.74,31.66 26.04,29.36 R13.1
D8
  Top 0.152: IC2.5 21.2,39.41 21.54,39.75 29.08,39.75 30.99,41.66 30.99,42.36 R12.1
D9
  Top 0.152: IC2.4 18.66,39.23 19.49,40.05 23.62,40.05 23.62,40.06 25.99,40.06 28.29,42.36
  Top 0.406: 28.29,42.36 R11.1
D10
  Top 0.152: IC2.3 16.12,39.44 17.04,40.36 23.49,40.36 R10.1
D11
  Top 0.152: IC2.2 13.58,40.15 14.19,40.76 22.19,40.76 22.79,41.36 22.79,42.11
  Top 0.406: 22.79,42.11 R9.1
D12
  Top 0.152: IC2.1 11.04,38.61 13.54,41.11 18.79,41.11 20.04,42.36
  Top 0.406: 20.04,42.36 R8.1
D13
  Top 0.152: IC1.1 7.79,24.86 7.79,40.61 9.59,42.41 R7.1
GND  (via drill 0.4)
  Top 0.406: R17.1 v36.29,42.41 | C2.2 v57.59,28.91 C3.2 59.74,29.61 U2.2 | R23.1 65.49,27.41 v65.79,27.71 C4.2 | v47.64,28.86 48.99,28.86 C1.2 49.79,29.65 50.09,29.65 50.29,29.86 U1.2 | R20.1 v47.64,26.61 | Q3.2 28.64,11.86 v27.29,11.86 | LED2.C v62.79,16.61 | Q1.2 v32.54,26.96 | LED1.C v57.29,16.61 | LED4.C v57.29,12.61 | LED3.C v62.79,12.61
  pour Route2: -0.21,53.56 64.59,53.56 66.24,51.91 66.24,40.51 68.79,37.96 68.79,5.01 66.24,2.46 66.24,-0.19 -0.21,-0.19
  pour Route15: -0.21,53.56 64.59,53.56 66.29,51.86 66.29,40.51 68.84,37.96 68.84,4.91 66.29,2.47 66.29,-0.24 -0.21,-0.24
N$1
  Top 0.406: D2.2 61.09,32.66 L2.2 61.14,30.71 U2.1
N$2
  Top 0.406: R31.1 R29.2 29.59,23.81 29.79,23.61 35.54,23.61 36.04,24.11 36.04,25.11 37.24,26.31 Q2.B
N$3
  Top 0.406: R23.2 R25.1 61.29,26.66 U2.3
N$4  (via drill 0.4)
  Top 0.406: v52.04,12.86 53.74,12.86 LED4.A | v52.04,22.61 52.04,24.31 R27.2
  Bottom 0.406: v52.04,12.86 v52.04,22.61
N$5
  Top 0.406: U1.1 51.14,30.96 L1.2 51.14,35.06 D1.2
N$6
  Top 0.406: R22.1 R20.2 51.29,26.91 U1.3
N$7
  Top 0.406: R28.2 R30.1 Q4.B
N$8
  Top 0.406: R26.2 57.24,10.36 LED3.A
N$9
  Top 0.406: Q3.3 30.89,14.26 R28.1
N$10
  Top 0.406: R24.2 43.49,14.11 52.04,14.11 52.79,14.86 58.04,14.86 59.49,16.31 LED2.A
N$11
  Top 0.406: R29.1 34.69,24.86 Q1.3
N$12
  Top 0.406: R21.2 53.24,15.86 LED1.A
RST_CONTROL
  Top 0.406: R13.2 Q1.1
RST_OUT  (via drill 0.4)
  Top 0.406: Q2.C 46.54,25.36 47.54,24.36 R27.1 50.04,24.31 v50.04,22.61
  Bottom 0.406: v50.04,22.61 50.04,21.11 47.29,18.36 34.54,18.36 32.98,16.8 JP1.6
VCC_ON
  Top 0.152: R1.1 26.54,17.61 28.54,19.61 30.29,19.61 31.36,20.68 IC1.9

### Text on the board
tNames: +12VSRC | +5VSRC | RESET | +5VOUT